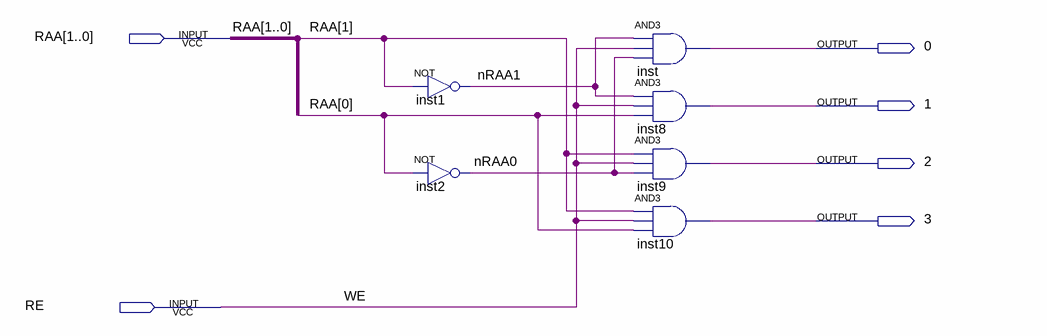
[diagram p0: schematic sheet]
// Quartus schematic De2to4.bdf as structural Verilog: 6 symbols, 6 pins
module De2to4 (
  input  [1:0] RAA,
  input  RE,
  output \0 ,
  output \1 ,
  output \2 ,
  output \3 
);

  wire nRAA0, nRAA1;

  not inst1 (nRAA1, RAA[1]);
  not inst2 (nRAA0, RAA[0]);
  and inst (\0 , nRAA1, RE, nRAA0);
  and inst8 (\1 , nRAA1, RE, RAA[0]);
  and inst9 (\2 , RAA[1], RE, nRAA0);
  and inst10 (\3 , RAA[1], RE, RAA[0]);

  // Other names for the same wires on the sheet: WE = RE
endmodule
